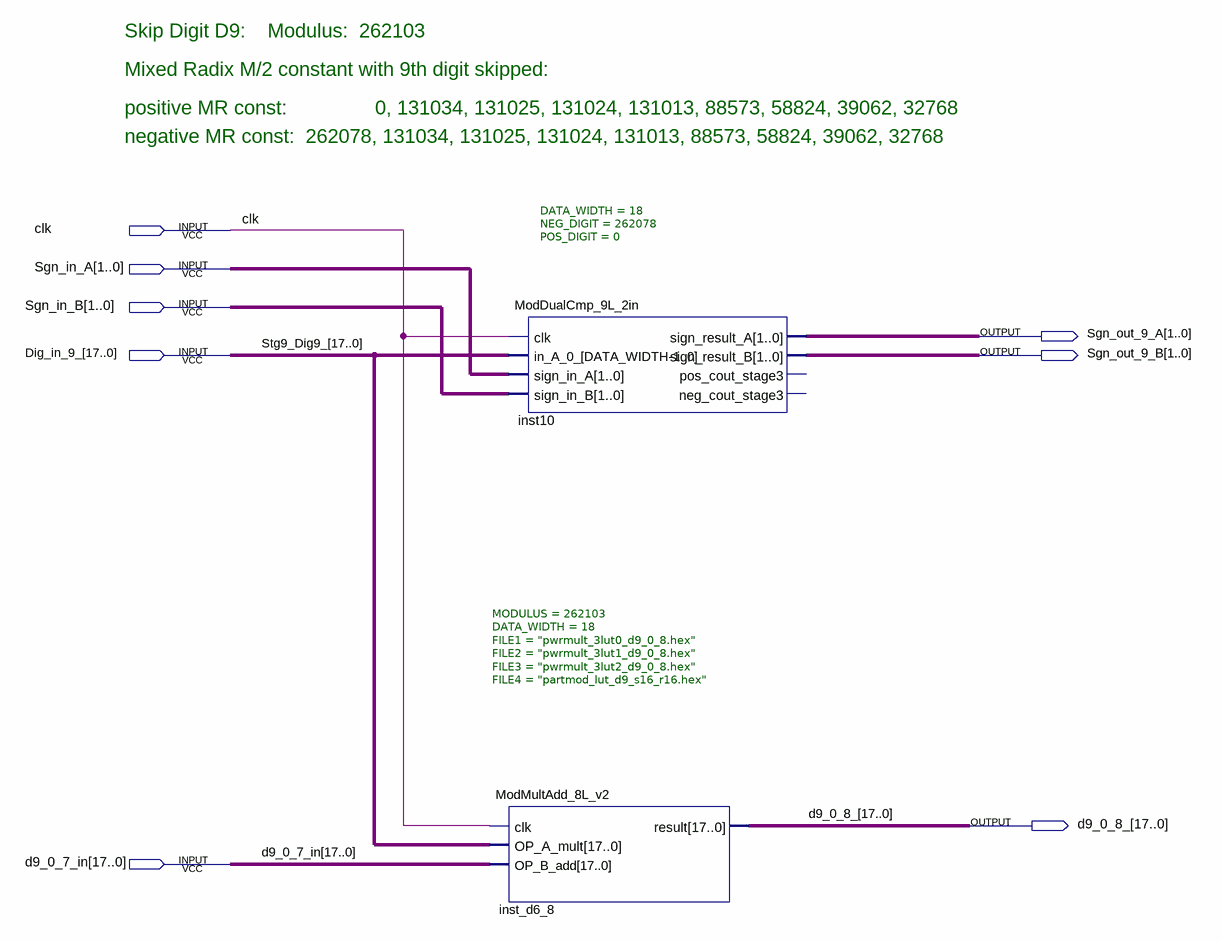
[diagram p0: schematic sheet]
// Quartus schematic MRC_pipe_mlab_ec_skp9.bdf as structural Verilog: 2 symbols, 8 pins
module MRC_pipe_mlab_ec_skp9 (
  input  clk,
  input  [1:0] Sgn_in_A,
  input  [1:0] Sgn_in_B,
  input  [17:0] Dig_in_9_,
  input  [17:0] d9_0_7_in,
  output [1:0] Sgn_out_9_A,
  output [1:0] Sgn_out_9_B,
  output [17:0] d9_0_8_
);

  ModMultAdd_8L_v2 #(.MODULUS(262103), .DATA_WIDTH(18), .FILE1("pwrmult_3lut0_d9_0_8.hex"), .FILE2("pwrmult_3lut1_d9_0_8.hex"), .FILE3("pwrmult_3lut2_d9_0_8.hex"), .FILE4("partmod_lut_d9_s16_r16.hex")) inst_d6_8 (
    .clk(clk), .OP_A_mult(Dig_in_9_), .OP_B_add(d9_0_7_in), .result(d9_0_8_));
  ModDualCmp_9L_2in #(.DATA_WIDTH(18), .NEG_DIGIT(262078), .POS_DIGIT(0)) inst10 (
    .clk(clk), .in_A_0_(Dig_in_9_), .sign_in_A(Sgn_in_A), .sign_in_B(Sgn_in_B), .sign_result_A(Sgn_out_9_A),
    .sign_result_B(Sgn_out_9_B));  // open: pos_cout_stage3, neg_cout_stage3

  // Other names for the same wires on the sheet: Stg9_Dig9_[17:0] = Dig_in_9_

  // Notes on the sheet:
  //   Skip Digit D9:    Modulus:  262103 
  //   Mixed Radix M/2 constant with 9th digit skipped:
  //   positive MR const:                0, 131034, 131025, 131024, 131013, 88573, 58824, 39062, 32768
  //   negative MR const:  262078, 131034, 131025, 131024, 131013, 88573, 58824, 39062, 32768
endmodule
